# EAGLE schematic axiom_beta_shield_ESP32_v0.1.74bba52c (EAGLE 7.7.0)
Assembly variants: Beta
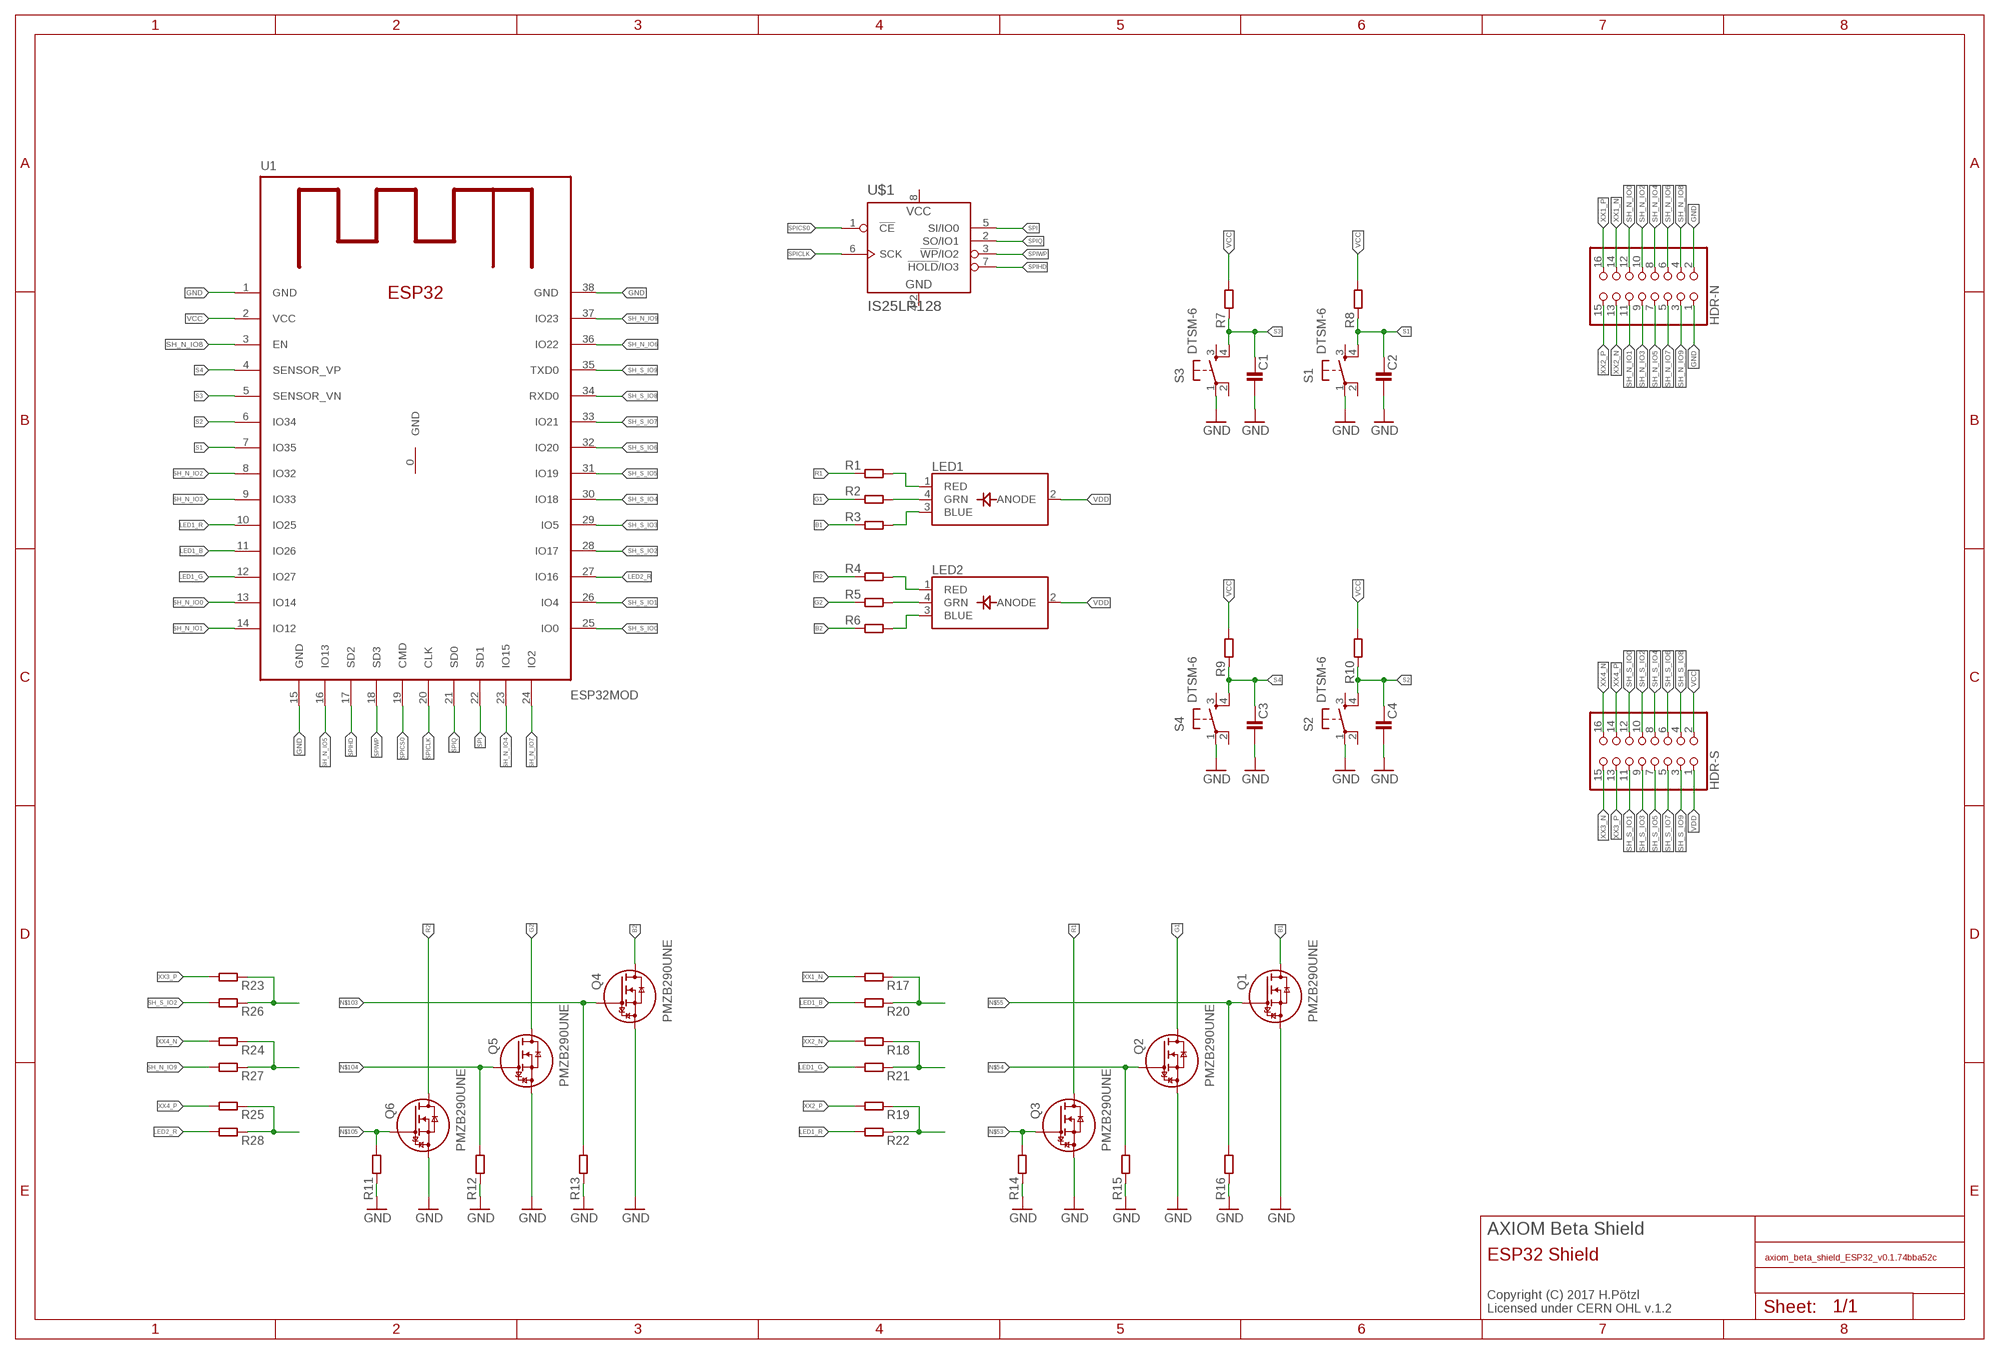
[diagram p0: schematic, sheet 1]

## Parts
C1  C0402-C  [0402-C]
C2  C0402-C  [0402-C]
C3  C0402-C  [0402-C]
C4  C0402-C  [0402-C]
HDR-N  PINHD-2X08_2.00_SMD  [2X08M_SMD]  (not fitted in variant Beta)
HDR-S  PINHD-2X08_2.00_SMD  [2X08M_SMD]  (not fitted in variant Beta)
LED1  LED_RGB_PLCC4  [RGBLED_PLCC4]
LED2  LED_RGB_PLCC4  [RGBLED_PLCC4]
Q1  PMZB290UNE  [SOT883(B)]
Q2  PMZB290UNE  [SOT883(B)]
Q3  PMZB290UNE  [SOT883(B)]
Q4  PMZB290UNE  [SOT883(B)]
Q5  PMZB290UNE  [SOT883(B)]
Q6  PMZB290UNE  [SOT883(B)]
R1  R0402-C  [0402-C]
R2  R0402-C  [0402-C]
R3  R0402-C  [0402-C]
R4  R0402-C  [0402-C]
R5  R0402-C  [0402-C]
R6  R0402-C  [0402-C]
R7  R0402-C  [0402-C]
R8  R0402-C  [0402-C]
R9  R0402-C  [0402-C]
R10  R0402-C  [0402-C]
R11  R0402-C  [0402-C]
R12  R0402-C  [0402-C]
R13  R0402-C  [0402-C]
R14  R0402-C  [0402-C]
R15  R0402-C  [0402-C]
R16  R0402-C  [0402-C]
R17  R0402-C  [0402-C]
R18  R0402-C  [0402-C]
R19  R0402-C  [0402-C]
R20  R0402-C  [0402-C]
R21  R0402-C  [0402-C]
R22  R0402-C  [0402-C]
R23  R0402-C  [0402-C]
R24  R0402-C  [0402-C]
R25  R0402-C  [0402-C]
R26  R0402-C  [0402-C]
R27  R0402-C  [0402-C]
R28  R0402-C  [0402-C]
S1  DTSM-6  [3X4MM]  (not fitted in variant Beta)
S2  DTSM-6  [3X4MM]  (not fitted in variant Beta)
S3  DTSM-6  [3X4MM]  (not fitted in variant Beta)
S4  DTSM-6  [3X4MM]  (not fitted in variant Beta)
U1  ESP32MOD  [ESP32MOD]
U$1  IS25LP128  [WSON127P600X500-8N]

## Nets
B1: Q1.3(D) R3.1
B2: Q4.3(D) R6.1
G1: Q2.3(D) R2.1
G2: Q5.3(D) R5.1
GND: C1.2 C2.2 C3.2 C4.2 HDR-N.1 HDR-N.2 Q1.2(S) Q2.2(S) Q3.2(S) Q4.2(S) Q5.2(S) Q6.2(S) R11.1 R12.1 R13.1 R14.1 R15.1 R16.1 S1.1 S2.1 S3.1 S4.1 U1.1(GND) U1.15(GND) U1.38(GND)
LED1_B: R20.2 U1.11(IO26)
LED1_G: R21.2 U1.12(IO27)
LED1_R: R22.2 U1.10(IO25)
LED2_R: R28.2 U1.27(IO16)
N$34: LED1.1(RED) R1.2
N$35: LED1.4(GRN) R2.2
N$36: LED1.3(BLUE) R3.2
N$37: LED2.1(RED) R4.2
N$38: LED2.4(GRN) R5.2
N$39: LED2.3(BLUE) R6.2
N$53: Q3.1(G) R14.2 R19.1 R22.1
N$54: Q2.1(G) R15.2 R18.1 R21.1
N$55: Q1.1(G) R16.2 R17.1 R20.1
N$103: Q4.1(G) R13.2 R23.1 R26.1
N$104: Q5.1(G) R12.2 R24.1 R27.1
N$105: Q6.1(G) R11.2 R25.1 R28.1
R1: Q3.3(D) R1.1
R2: Q6.3(D) R4.1
S1: C2.1 R8.1 S1.4 U1.7(IO35)
S2: C4.1 R10.1 S2.4 U1.6(IO34)
S3: C1.1 R7.1 S3.4 U1.5(SENSOR_VN)
S4: C3.1 R9.1 S4.4 U1.4(SENSOR_VP)
SH_N_IO0: HDR-N.12 U1.13(IO14)
SH_N_IO1: HDR-N.11 U1.14(IO12)
SH_N_IO2: HDR-N.10 U1.8(IO32)
SH_N_IO3: HDR-N.9 U1.9(IO33)
SH_N_IO4: HDR-N.8 U1.23(IO15)
SH_N_IO5: HDR-N.7 U1.16(IO13)
SH_N_IO6: HDR-N.6 U1.36(IO22)
SH_N_IO7: HDR-N.5 U1.24(IO2)
SH_N_IO8: HDR-N.4 U1.3(EN)
SH_N_IO9: HDR-N.3 R27.2 U1.37(IO23)
SH_S_IO0: HDR-S.12 U1.25(IO0)
SH_S_IO1: HDR-S.11 U1.26(IO4)
SH_S_IO2: HDR-S.10 R26.2 U1.28(IO17)
SH_S_IO3: HDR-S.9 U1.29(IO5)
SH_S_IO4: HDR-S.8 U1.30(IO18)
SH_S_IO5: HDR-S.7 U1.31(IO19)
SH_S_IO6: HDR-S.6 U1.32(IO20)
SH_S_IO7: HDR-S.5 U1.33(IO21)
SH_S_IO8: HDR-S.4 U1.34(RXD0)
SH_S_IO9: HDR-S.3 U1.35(TXD0)
SPI: U1.22(SD1) U$1.5(SI/IO0)
SPICLK: U1.20(CLK) U$1.6(SCK)
SPICS0: U1.19(CMD) U$1.1(!CE)
SPIHD: U1.17(SD2) U$1.7(!HOLD!/IO3)
SPIQ: U1.21(SD0) U$1.2(SO/IO1)
SPIWP: U1.18(SD3) U$1.3(!WP!/IO2)
VCC: HDR-S.2 R7.2 R8.2 R9.2 R10.2 U1.2(VCC)
VDD: HDR-S.1 LED1.2(ANODE) LED2.2(ANODE)
XX1_N: HDR-N.14 R17.2
XX1_P: HDR-N.16
XX2_N: HDR-N.13 R18.2
XX2_P: HDR-N.15 R19.2
XX3_N: HDR-S.15
XX3_P: HDR-S.13 R23.2
XX4_N: HDR-S.16 R24.2
XX4_P: HDR-S.14 R25.2
Unconnected: S1.2 S1.3 S2.2 S2.3 S3.2 S3.3 S4.2 S4.3

## Notes on the sheet
- AXIOM Beta Shield
- ESP32 Shield
- Copyright (C) 2017 H.Pötzl
  Licensed under CERN OHL v.1.2

## Power pins joined to a net without a drawn wire
GND: U1.0(GND) U$1.4(GND) U$1.PAD(GND)
VCC: U$1.8(VCC)

## Library data of the parts
C1-C4 = generic-rcl:C
HDR-N HDR-S = pincon:PINHD-2X08: PIN HEADER
LED1 LED2 = microbuilder:LED_RGB_PLCC4: RGB LED - PLCC4 Cree 20mA Common Anode Digikey: CLV1A-FKB-CJ1M1F1BB7R4S3CT-ND Red: 2.6V Vf, 550mcd Green: 3.2V Vf, 850mcd Blue: 3.2V Vf, 320mcd
Q1-Q6 = transistor:PMZB290UNE: 20 V, single N-channel Trench MOSFET Herbert Poetzl
R1-R28 = generic-rcl:R
S1-S4 = switch:DTSM-6
U1 = ESP32:ESP32MOD: ESP32 Module Espressif
U$1 = eeprom:IS25LP128

## Net classes
0 default: width 0.152 mm, drill 0.254 mm
1 power: width 0.152 mm, drill 0.254 mm